# EAGLE design TraceurDessinateur_Manette (EAGLE 9.6.2)
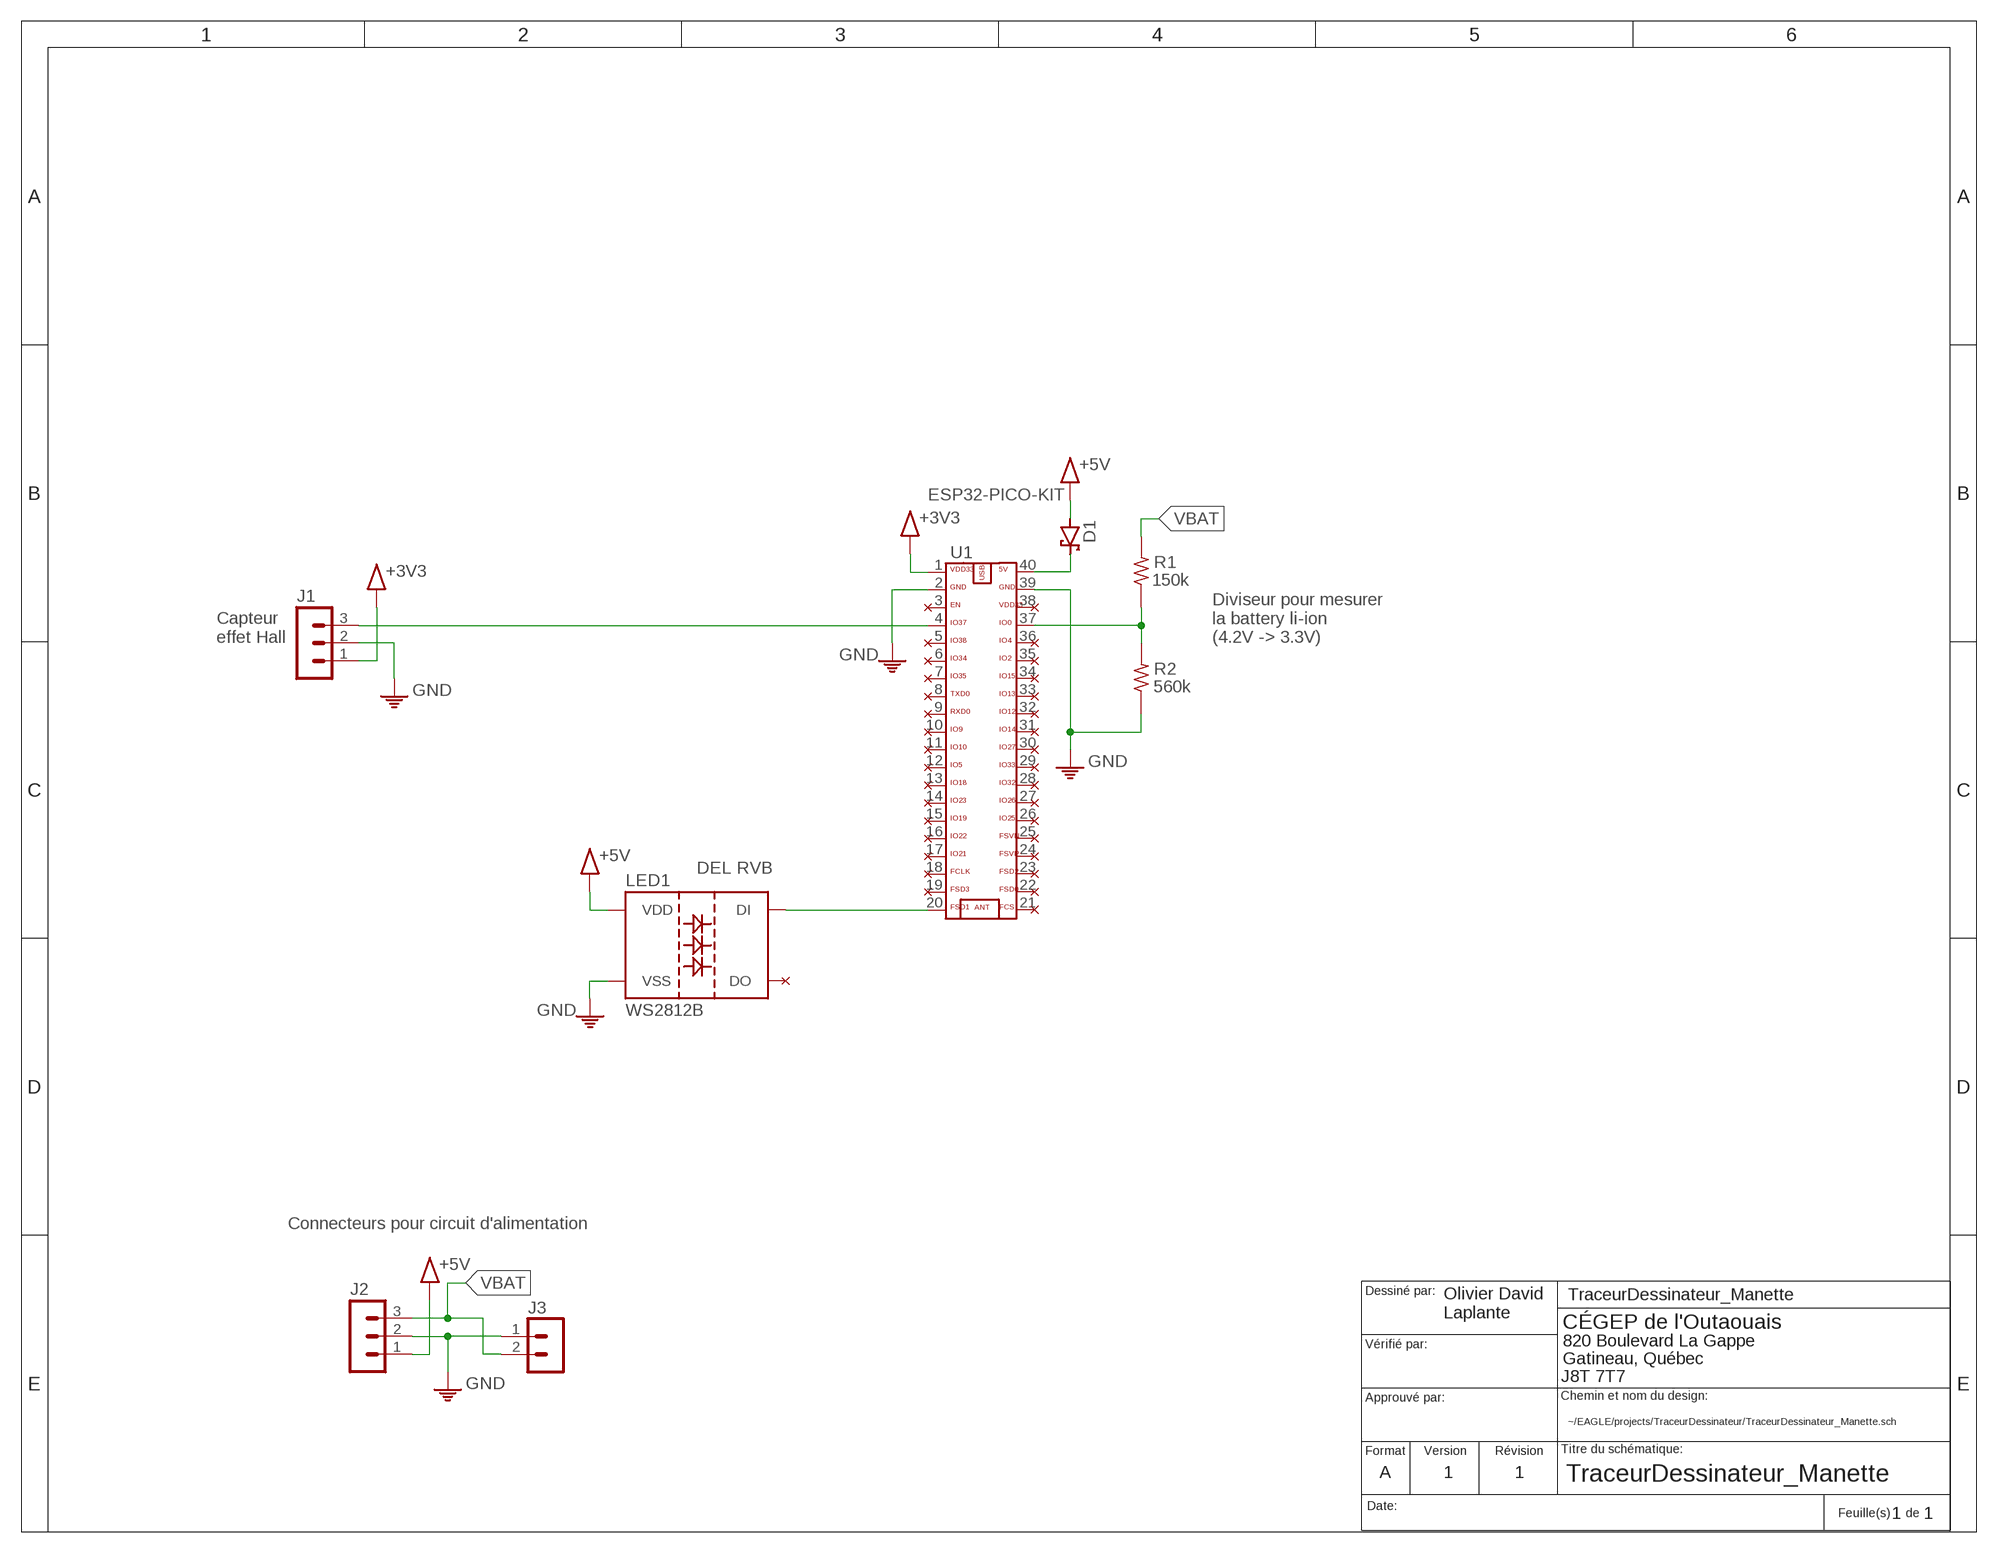
[diagram p0: schematic, sheet 1]

## Parts
D1  1N5817-B  [DO41-7.6]
J1  MA03-1  [MA03-1]
J2  MA03-1  [MA03-1]
J3  B2B-PH-K  [B2B-PH-K]
LED1  WS2812B  [WS2812B]
R1  150k  RR1206W  [R1206W]
R2  560k  RR1206W  [R1206W]
U1  ESP32-PICO-V4-SOCKET  [ESP32-PICO-V4-SOCKET]
U$1  NC  (no package)
U$2  NC  (no package)
U$3  NC  (no package)
U$4  NC  (no package)
U$5  NC  (no package)
U$6  NC  (no package)
U$7  NC  (no package)
U$8  NC  (no package)
U$9  NC  (no package)
U$10  NC  (no package)
U$11  NC  (no package)
U$12  NC  (no package)
U$13  NC  (no package)
U$14  NC  (no package)
U$15  NC  (no package)
U$16  NC  (no package)
U$17  NC  (no package)
U$18  NC  (no package)
U$19  NC  (no package)
U$20  NC  (no package)
U$21  NC  (no package)
U$22  NC  (no package)
U$23  NC  (no package)
U$24  NC  (no package)
U$25  NC  (no package)
U$26  NC  (no package)
U$27  NC  (no package)
U$28  NC  (no package)
U$29  NC  (no package)
U$30  NC  (no package)
U$31  NC  (no package)
U$32  NC  (no package)
U$33  NC  (no package)
U$34  NC  (no package)

## Nets
+3V3: J1.1 U1.1(3V3)
+5V: D1.A J2.1 LED1.1(VDD)
ADC_HALL: J1.3 U1.4
GND: J1.2 J2.2 J3.1 LED1.3(VSS) R2.1 U1.2 U1.39
LED_DATA: LED1.4(DI) U1.20
N$1: LED1.2(DO) U$2.P$1
N$2: U1.3 U$3.P$1
N$3: U1.38 U$1.P$1
N$4: U1.5 U$4.P$1
N$5: U1.6 U$5.P$1
N$6: U1.7 U$6.P$1
N$7: U1.8 U$7.P$1
N$8: U1.9 U$8.P$1
N$9: U1.10 U$9.P$1
N$10: U1.11 U$10.P$1
N$11: U1.12 U$11.P$1
N$12: U1.13 U$12.P$1
N$13: U1.14 U$13.P$1
N$14: U1.15 U$14.P$1
N$15: U1.16 U$15.P$1
N$16: U1.17 U$16.P$1
N$17: U1.18 U$17.P$1
N$18: U1.19 U$18.P$1
N$19: U1.21 U$19.P$1
N$20: U1.22 U$20.P$1
N$21: U1.23 U$21.P$1
N$22: U1.24 U$22.P$1
N$23: U1.25 U$23.P$1
N$24: U1.26 U$24.P$1
N$25: U1.27 U$25.P$1
N$26: U1.28 U$26.P$1
N$27: U1.29 U$27.P$1
N$28: U1.30 U$28.P$1
N$29: U1.31 U$29.P$1
N$30: U1.32 U$30.P$1
N$31: U1.33 U$31.P$1
N$32: U1.34 U$32.P$1
N$33: U1.35 U$33.P$1
N$34: U1.36 U$34.P$1
N$35: D1.C U1.40
VBAT: J2.3 J3.2 R1.2
VSENSE: R1.1 R2.2 U1.37

## Notes on the sheet
- ESP32-PICO-KIT
- Capteur 
  effet Hall
- Diviseur pour mesurer
  la battery li-ion 
  (4.2V -> 3.3V)
- DEL RVB
- Connecteurs pour circuit d'alimentation
- TraceurDessinateur_Manette
- Olivier David
  Laplante
- ~/EAGLE/projects/TraceurDessinateur/TraceurDessinateur_Manette.sch
- A | 1 | 1
- 1 | 1

## Library data of the parts
D1 = diode:1N581*: 1.0A SCHOTTKY BARRIER RECTIFIER Source: http://www.diodes.com/datasheets/ds23001.pdf
J1 J2 = con-lstb:MA03-1: PIN HEADER; OC_FARNELL: unknown; OC_NEWARK: unknown
J3 = con-jst-ph:B2B-PH-K: HEADER
LED1 = WS2812:WS2812B
R1 R2 = 1_TGE:R: R
U1 = esp32-pico-v4-header:ESP32-PICO-V4-SOCKET: ESP32-PICO-V4-SOCKET This low cost ESP32 board can mount on a socket making it an easy daughterboard solution. Pinout Reference <https://docs.espressif.com/projects/esp-idf/en/latest/get-started/get-started-pico-kit.html#header-j2> As of end of 2018 these are $8 each from DigiKey <https://www.digikey.com/product-detail/en/espressif-systems/ESP32-PICO-KIT/1904-1030-ND/9381703?utm_adgroup=RF%20&%20RFID> Actual sockets needed are 1x20 (x2) although the bottom three pins on each side are not brought off the board. As of the end of 2018 these headers are $0.68 each (x1) at Phoenix Enterprises. <https://www.peconnectors.com/female-headers-pcb-1x-row-.100/hws15775/>
U$1-U$34 = 1_Personnal:NC

## Board
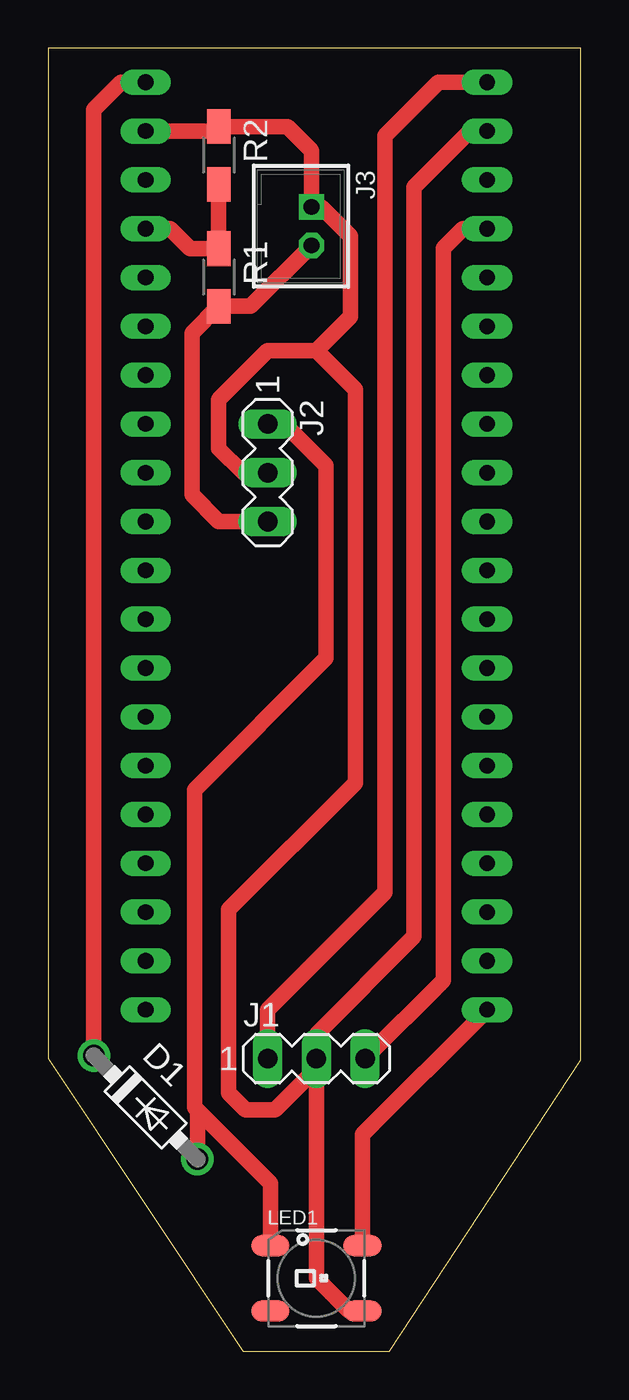
[diagram p1: board, top side]
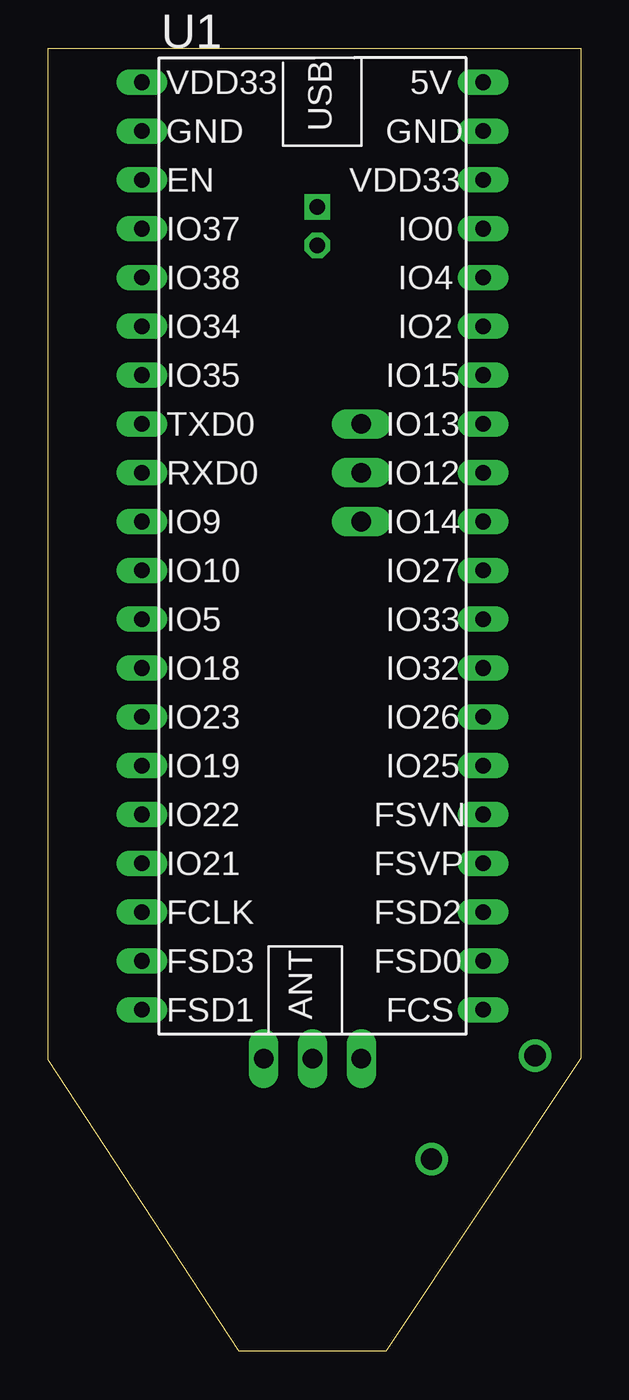
[diagram p2: board, bottom side, seen from below]

Size 27.74 x 67.82 mm. Coordinates in mm from the lower left corner, seen from the top.
Outline: 0,67.82 0,15.24 10.16,0 17.78,0 27.74,15.16 27.74,67.81 0,67.82
Copper layers (1*16): Top 0.035mm / dielectric 1.5mm / Bottom 0.035mm
Design rules "default *": minimum track width 6mil, minimum drill 0.35mm, track to track 6mil, track to pad 6mil, pad to pad 6mil, via to via 6mil, smd to smd 6mil, copper to edge 40mil, drill to drill 6mil, minimum pad ring 10mil, minimum via ring 8mil, stop-mask expansion 4mil, vias tented up to drill 0mil, thermal gap 10mil

### Footprints (pad centres in the part's own frame; a part is rotated, then mirrored left to right if it is on the bottom)
DO41-7.6 = drill 1.1 pad 1.7: A 3.81,0; C -3.81,0
MA03-1 = drill 1.016 long: 1 -2.54,0; 2 0,0; 3 2.54,0
B2B-PH-K = drill 0.813 square: 1 -1,0 | drill 0.813 octagon: 2 1,0
WS2812B = smd 2 x 1.1: 1 -2.4,1.7; 2 -2.4,-1.7; 3 2.4,-1.7; 4 2.4,1.7
R1206W = smd 1.8 x 1.2: 1 -1.499,0; 2 1.499,0
ESP32-PICO-V4-SOCKET = drill 0.813 long: 1 -8.89,29.21; 2 -8.89,26.67; 3 -8.89,24.13; 4 -8.89,21.59; 5 -8.89,19.05; 6 -8.89,16.51; 7 -8.89,13.97; 8 -8.89,11.43; 9 -8.89,8.89; 10 -8.89,6.35; 11 -8.89,3.81; 12 -8.89,1.27; 13 -8.89,-1.27; 14 -8.89,-3.81; 15 -8.89,-6.35; 16 -8.89,-8.89; 17 -8.89,-11.43; 18 -8.89,-13.97; 19 -8.89,-16.51; 20 -8.89,-19.05; 21 8.89,-19.05; 22 8.89,-16.51; 23 8.89,-13.97; 24 8.89,-11.43; 25 8.89,-8.89; 26 8.89,-6.35; 27 8.89,-3.81; 28 8.89,-1.27; 29 8.89,1.27; 30 8.89,3.81; 31 8.89,6.35; 32 8.89,8.89; 33 8.89,11.43; 34 8.89,13.97; 35 8.89,16.51; 36 8.89,19.05; 37 8.89,21.59; 38 8.89,24.13; 39 8.89,26.67; 40 8.89,29.21

### Placement (x,y rotation side)
D1  5.08,12.7 315 top
J1  13.97,15.24 0 top
J2  11.43,45.72 270 top
J3  13.72,58.55 270 top
LED1  13.97,3.81 0 top
R1  8.89,55.88 270 top
R2  8.89,62.23 270 top
U1  13.97,36.83 0 bottom
U$35  [A3L-LOC]  -11.43,-10.16 0 top  (outside the outline)

### Tracks (layer width: path | path; a pad name or v marks a point on that pad's centre or on a via)
+3V3
  Top 0.813: J1.1 11.43,17.78 17.53,23.88 17.53,63.25 20.32,66.04 U1.1
+5V
  Top 0.813: LED1.1 11.57,8.75 7.77,12.55 | J2.1 12.32,48.26 14.48,46.1 14.48,36.07 7.62,29.21 7.62,12.7 7.77,12.55 | D1.A 7.77,12.55
ADC_HALL
  Top 0.813: J1.3 20.57,19.3 20.57,57.4 21.59,58.42 U1.4
GND
  Top 0.813: U1.39 8.66,63.5 R2.1 12.47,63.73 13.72,62.48 J3.1 14.22,59.55 15.75,58.02 15.75,53.85 13.97,52.07 | LED1.3 15.67,2.11 13.97,3.81 J1.2 | J1.2 13.97,16.51 19.05,21.59 19.05,60.58 21.97,63.5 U1.2 | J2.2 10.16,45.72 8.89,46.99 8.89,49.53 11.43,52.07 13.97,52.07 | 13.97,52.07 16,50.04 16,29.59 9.4,22.99 9.4,13.46 10.29,12.57 11.81,12.57 13.97,14.73 J1.2
LED_DATA
  Top 0.813: LED1.4 16.37,11.29 U1.20
N$35
  Top 0.813: D1.C 2.39,64.62 3.81,66.04 U1.40
VBAT
  Top 0.813: J2.3 8.89,43.18 7.49,44.58 7.49,52.98 R1.2 10.55,54.38 J3.2
VSENSE
  Top 0.813: R2.2 R1.1 7.39,57.38 6.35,58.42 U1.37

### Text on the board
Document: Dessine par: / Olivier David Laplante | Format : A4 | Version: 1.0 | 1 de 1 | CEGEP de l'Outaouais / 820 Boulevard La Gappe / Gatineau, Quebec / J8T 7T7